# EasyEDA Pro project ProPrj_PCB_PoolMaster_Addons_2025-04-24.epro

# Board PCB_PCB_PoolMaster_2025-04-23
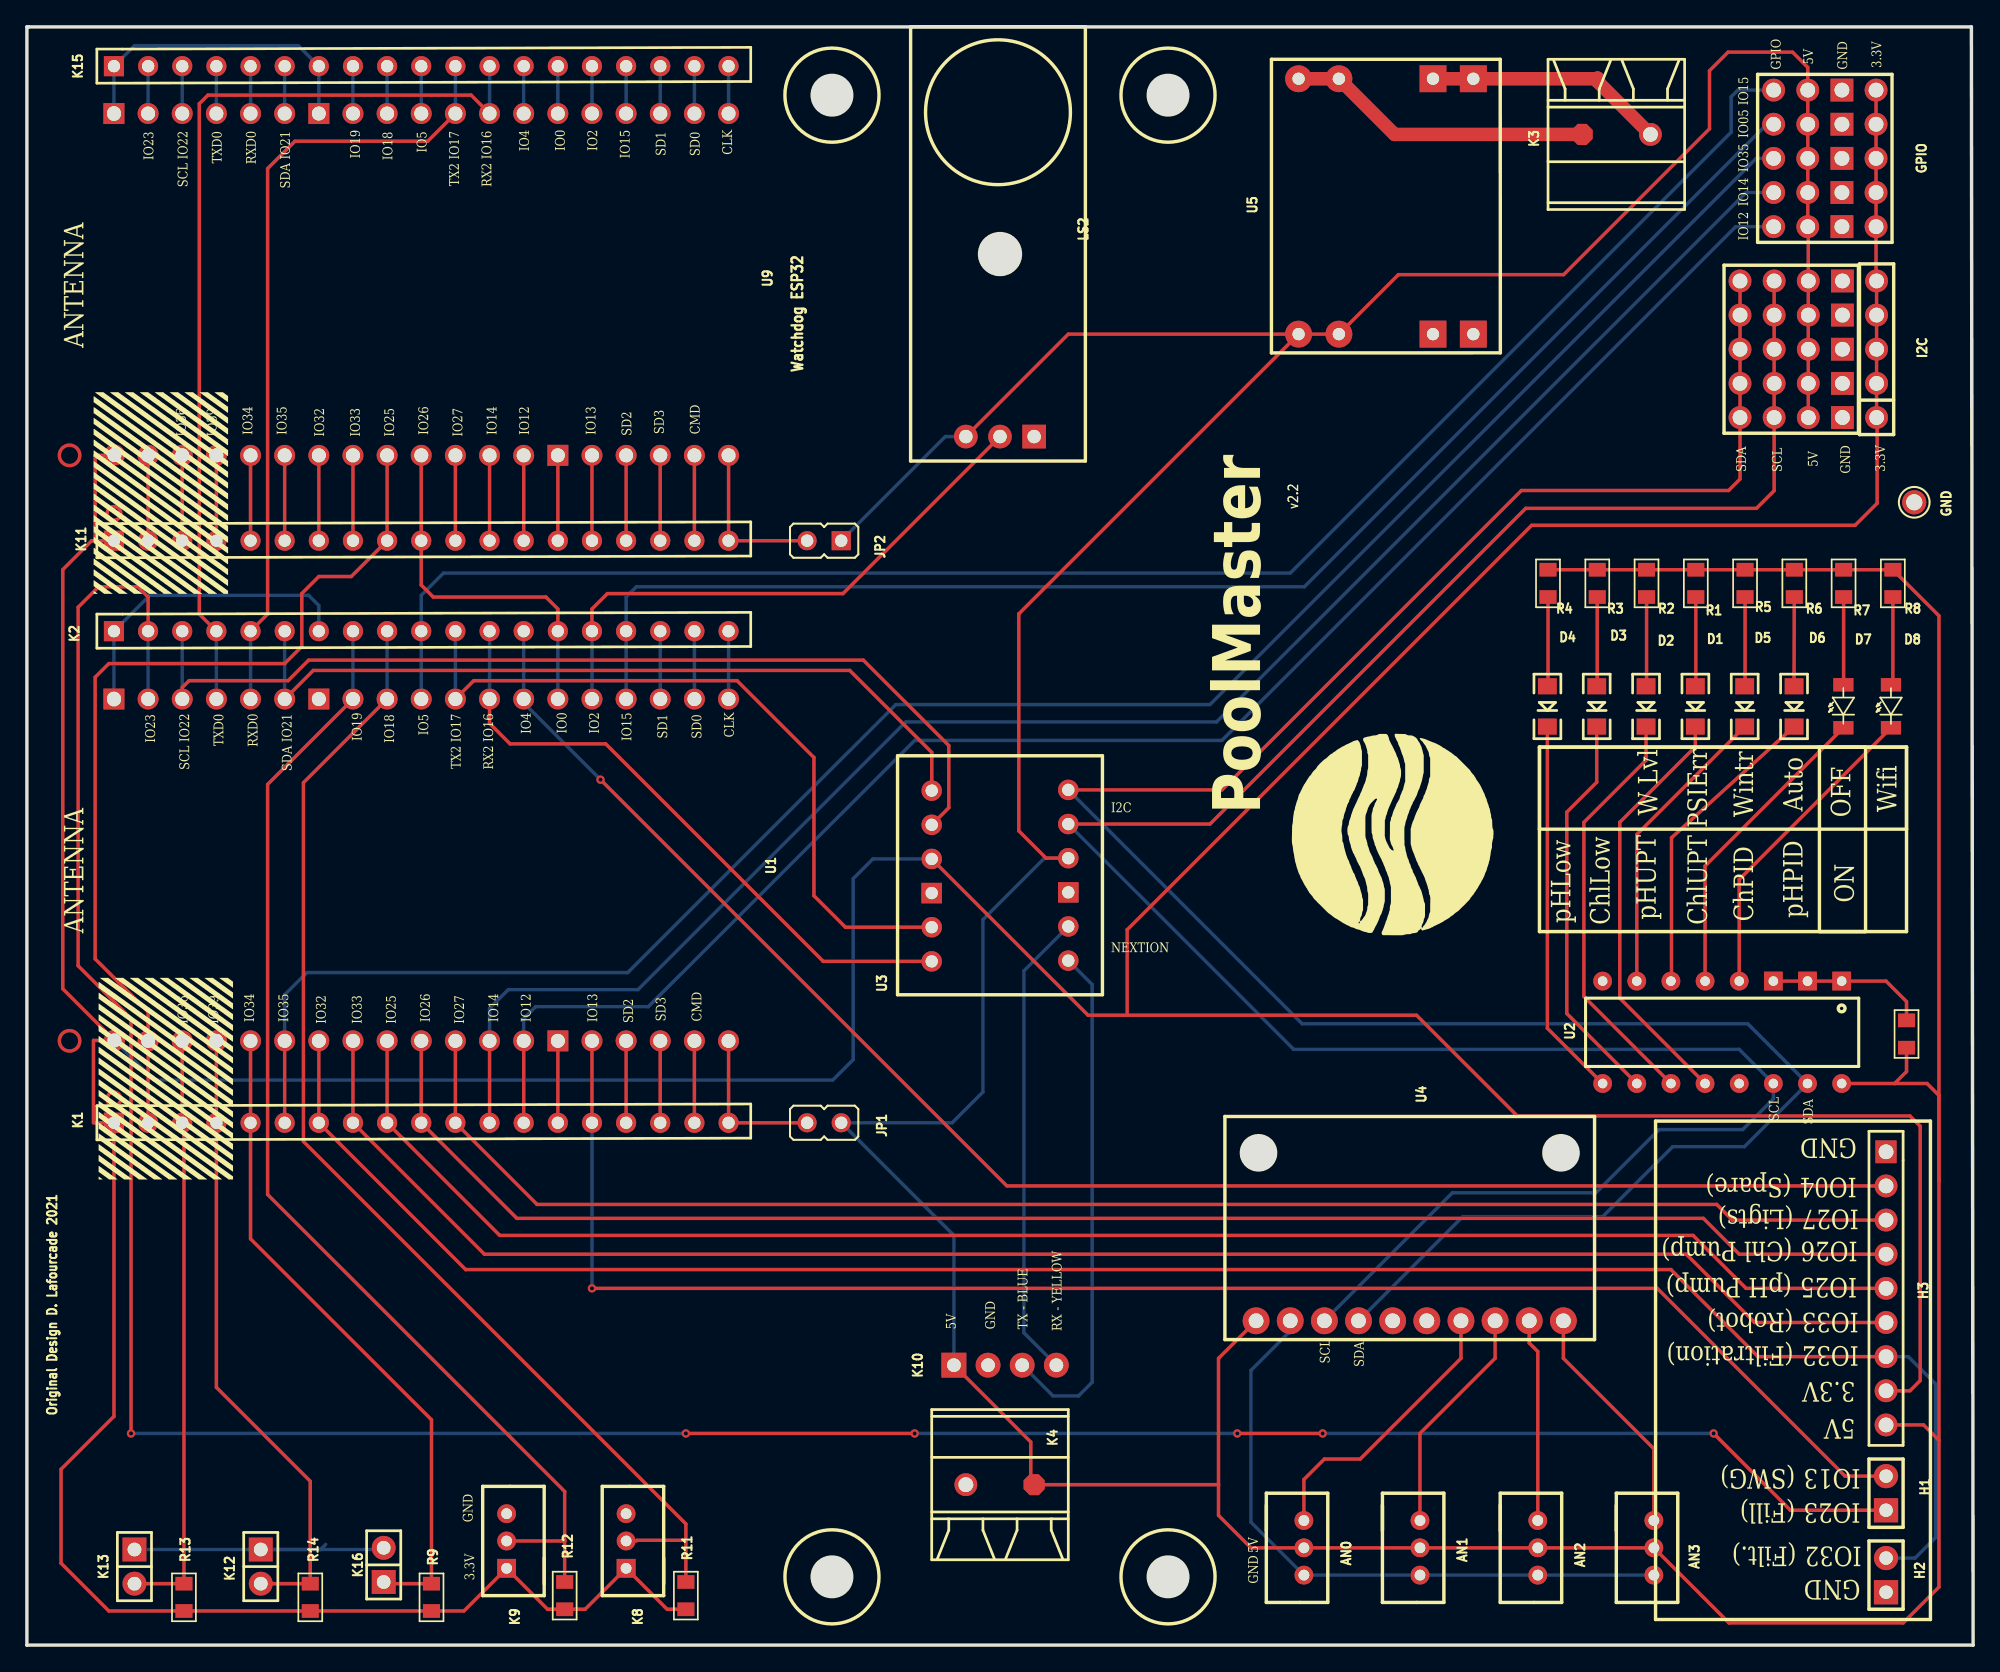
[diagram p0: board, top side]
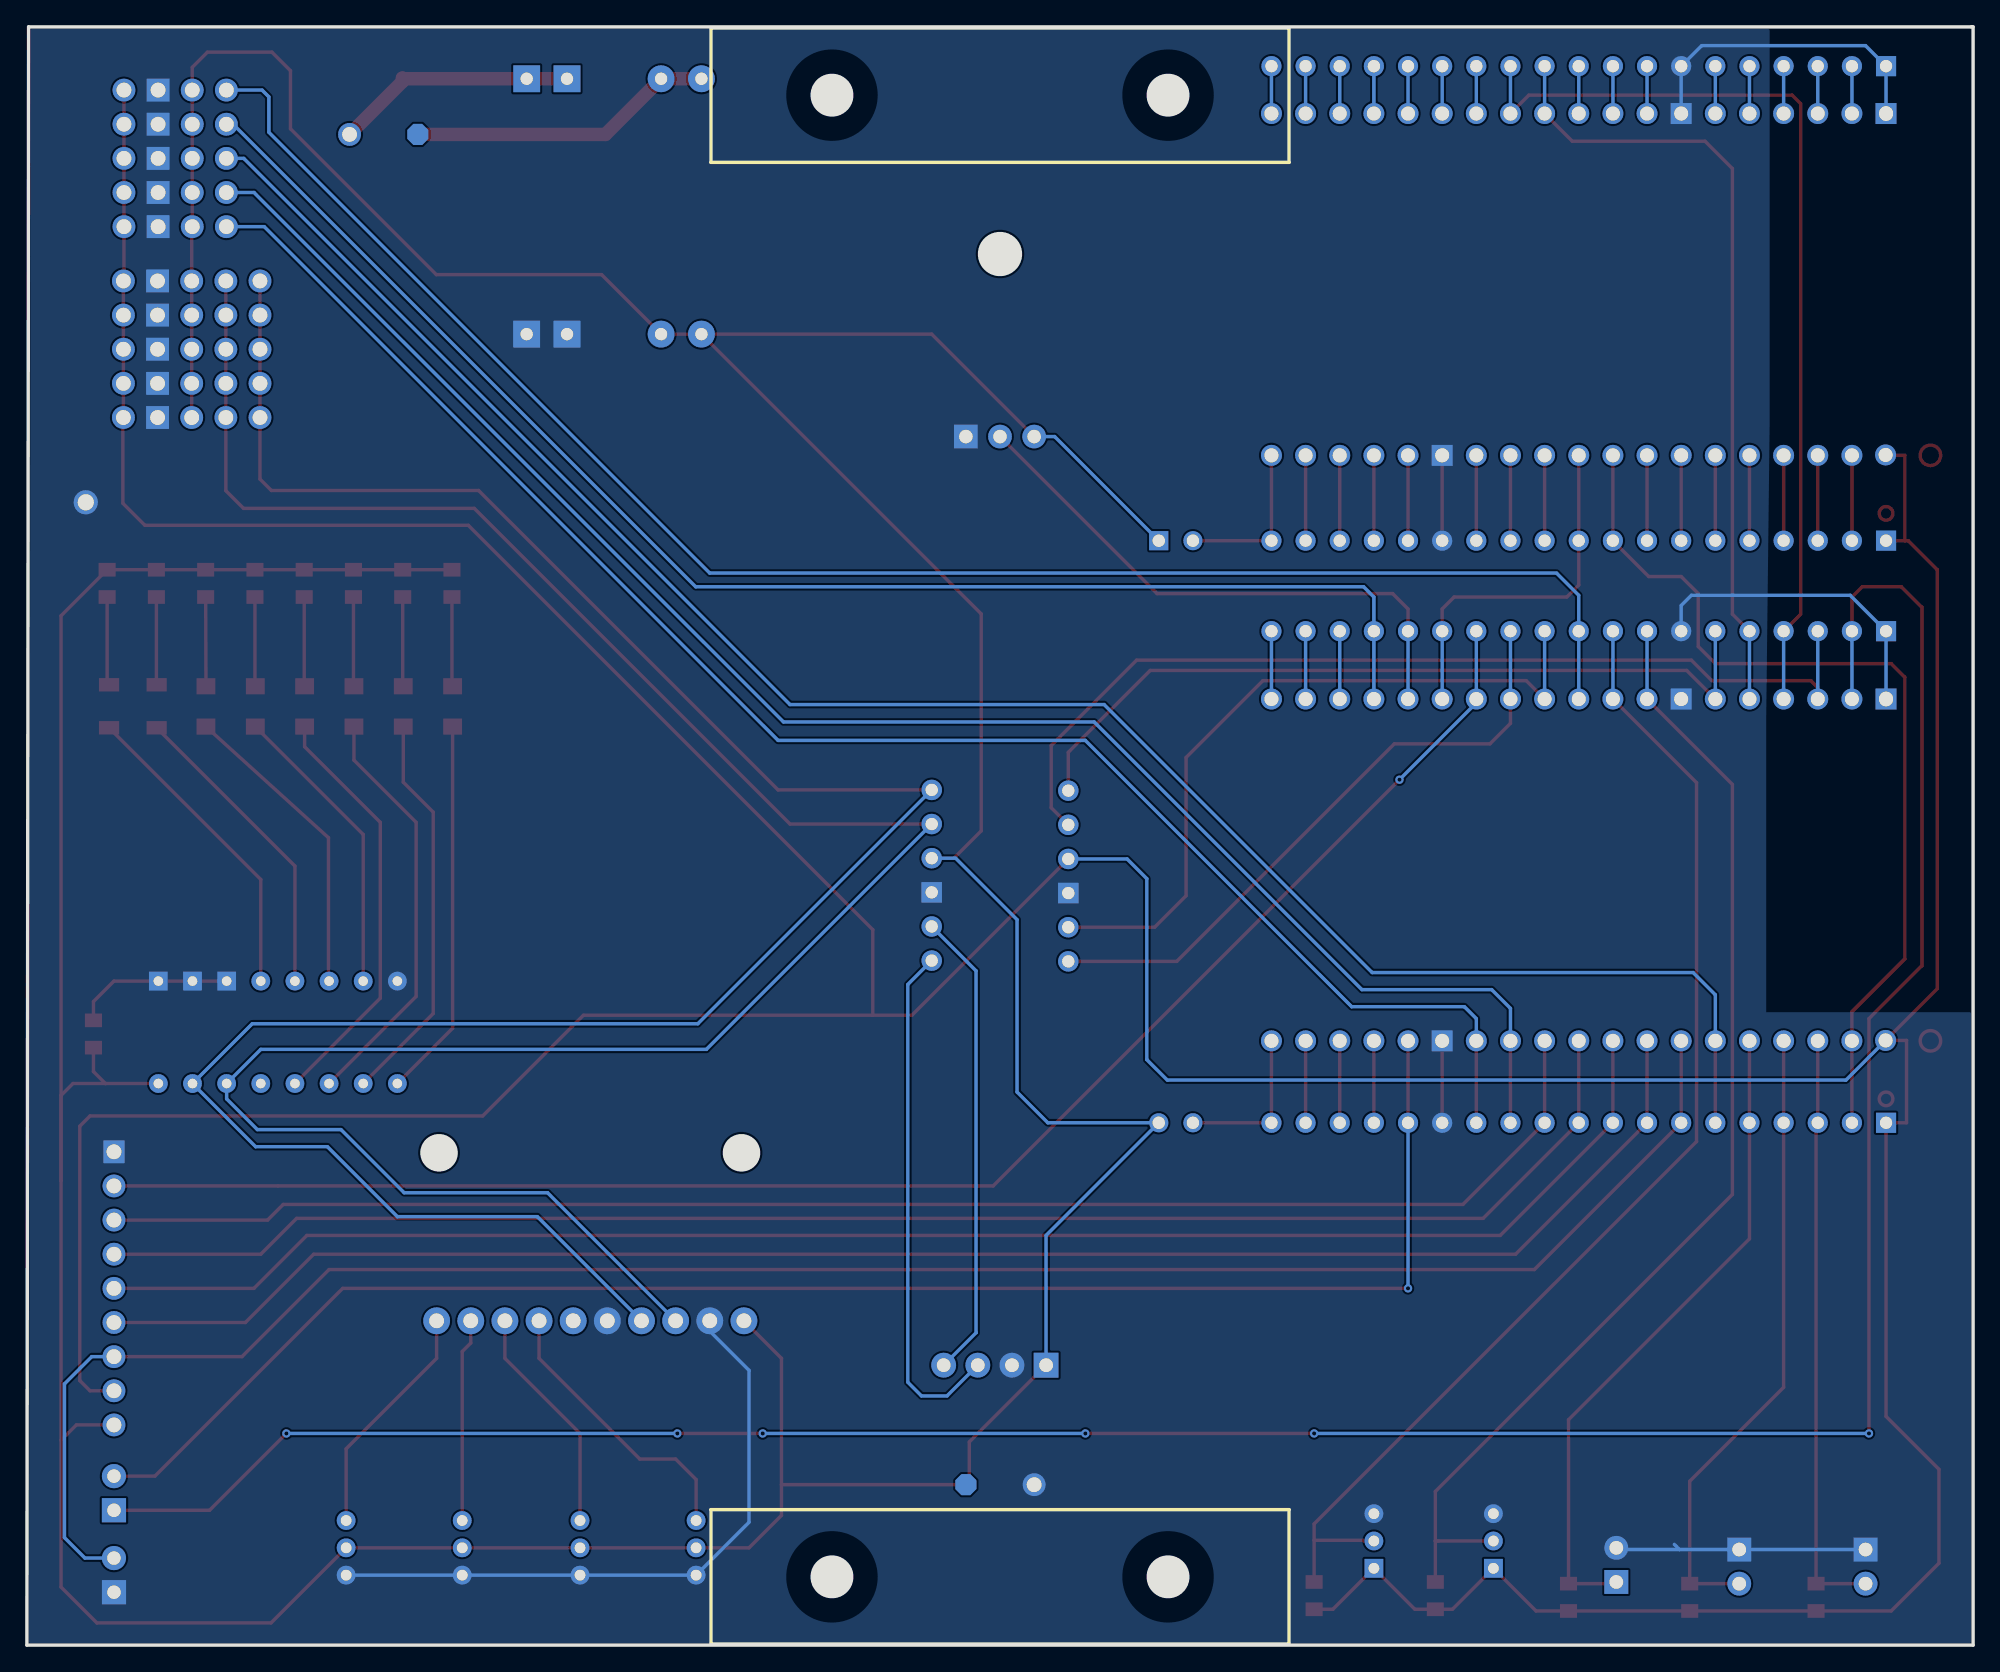
[diagram p1: board, bottom side, seen from below]

Outline 144.78 x 120.4 mm; copper layers: Top Layer, Bottom Layer. Coordinates in mm from the lower left corner of the outline.
Outline path: 0.13,120.4 0,120.4 0,0 144.78,0 144.65,120.4 0.14,120.4
Stack: Top Layer 0.035mm / Dielectric1 1.51mm FR4 er 4.5 / Bottom Layer 0.035mm

## Design rules (mm)
spacing Default (default): track to track 0.152, other pairs 0 to 0.152
track width Default (default): min 0.254, default 0.254, max 25.4
differential pair differentialPair (default): width min 0.127, default 0.254, max 2.54; gap min 0.152, default 0.152
via Default (default): diameter min 0.61, default 0.61, max 100.025; hole min 0.305, default 0.305, max 59.995
pour e116 uses gge23784

## Placement (name value [footprint] x y rotation side)
AN0  Orp  [JST_1X3_2MM_AW]  95 6.22 180 top
AN1  pH  [JST_1X3_2MM_AW]  103.63 6.22 180 top
AN2  W Press  [JST_1X3_2MM_AW]  112.4 6.22 180 top
AN3  RFU  [JST_1X3_2MM_AW]  121.03 6.22 180 top
C1  100n  [0805C-GENERIC]  139.83 44.7 90 top
D1  Red  [SMD-LED-1206-PACKAGE-RED-FP]  124.12 69.84 270 top
D2  Red  [SMD-LED-1206-PACKAGE-RED-FP]  120.45 69.84 270 top
D3  Red  [SMD-LED-1206-PACKAGE-RED-FP]  116.78 69.84 270 top
D4  Red  [SMD-LED-1206-PACKAGE-RED-FP]  113.11 69.84 270 top
D5  Green  [SMD-LED-1206-PACKAGE-GREEN-FP]  127.79 69.84 270 top
D6  Green  [SMD-LED-1206-PACKAGE-GREEN-FP]  131.46 69.84 270 top
D7  Yellow  [SMD-LED-1206]  135.13 69.85 270 top
D8  Blue  [SMD-LED-1206]  138.67 69.85 270 top
GND  TESTPOINT  [TESTPOINT-TH_BD2.0-D1.0_TESTPOINT-TH_BD2.0-D1.0]  140.4 85.03 0 top
GPIO  HX PZ2.54-4x5P ZZ  [HDR-TH_20P-P2.54-V-M-R4-C5-S2.54#2]  133.75 110.61 90 top
H1  Header-Male-2.54_1x2  [HDR-TH_2P-P2.54-V-M-1]  138.3 11.3 90 top
H2  Header-Male-2.54_1x2  [HDR-TH_2P-P2.54-V-M-1]  138.3 5.21 90 top
H3  Header-Female-2.54_1x9  [HDR-TH_9P-P2.54-V-F-1]  138.3 26.54 270 top
I2C  HX PZ2.54-4x5P ZZ  [HDR-TH_20P-P2.54-V-M-R4-C5-S2.54]  131.25 96.41 90 top
JP1  U/L  [JUMPER-2.54#2]  58.04 38.86 270 top
JP2  U/L  [JUMPER-2.54]  60.58 82.17 90 top
K1  Header 19  [HDR1X19]  29.34 38.86 0 top
K2  Header 19  [HDR1X19]  29.34 75.44 0 top
K3  4.5-24V  [MKDS3_2RMI]  115.7 112.39 0 top
K4  Output 5V  [MKDS3_2RMI]  74.93 11.94 180 top
K8  Air T  [JST_1X3_2MM_AW#2]  44.58 8.76 0 top
K9  Water T  [JST_1X3_2MM_AW#2]  35.69 8.76 0 top
K10  Display  [HEADER-1X4-PTH-FOOTPRINT-1]  72.77 20.83 0 top
K11  Header 19  [HDR1X19]  29.34 82.17 0 top
K12  Chl Level  [HEADER-1X2#2]  17.4 4.57 180 top
K13  pH Level  [HEADER-1X2#2]  8 4.57 180 top
K15  Header 19  [HDR1X19]  29.34 117.47 0 top
K16  Pool Level  [HEADER-1X2]  26.54 4.7 180 top
LS2  MH-FMD_BUZZER_MODULE COPY  [MH-FMD_ACTIVE_BUZZER_MODULE]  78.74 120.4 270 top
R1  3k3  [0805R-33]  124.15 79.76 270 top
R2  3k3  [0805R-33]  120.49 79.76 270 top
R3  3k3  [0805R-33]  116.82 79.76 270 top
R4  3k3  [0805R-33]  113.16 79.76 270 top
R5  3k3  [0805R-33]  127.82 79.76 270 top
R6  3k3  [0805R-33]  131.48 79.76 270 top
R7  3k3  [0805R-33]  135.15 79.76 270 top
R8  3k3  [0805R-33]  138.81 79.76 270 top
R9  10k  [0805R-10K]  30.1 2.54 90 top
R11  10k  [0805R-10K]  49.02 2.67 90 top
R12  10k  [0805R-10K]  40 2.67 90 top
R13  10k  [0805R-10K]  11.68 2.54 90 top
R14  10k  [0805R-10K]  21.08 2.54 90 top
U1  ESP32 DevKit  [ESP32-DEVKITC-32D_MODULE_ESP32-DEVKITC-32D]  29.08 57.66 90 top
U2  PCF8574AN  [DIP16]  126.11 45.59 180 top
U3  SHIFTER 4CH  [SPARKFUN_LOGIC_LEVEL_CONVERTER]  72.39 50.93 0 top
U4  ADS1115  [COMM-TH_ADS1115-MODULE]  102.87 24.13 0 top
U5  MP1584EN  [DC-DC CONVERTER]  109.6 105.54 270 top
U6  .  [DIN_RAIL_HOLDER]  72.39 5.08 0 top
U7  .  [DIN_RAIL_HOLDER]  72.39 115.32 180 top
U9  ESP32 DevKit  [ESP32-DEVKITC-32D_MODULE_ESP32-DEVKITC-32D]  29.08 101.22 90 top
U12  2541WV-05P  [HDR-TH_5P-P2.54-V-M]  137.6 96.41 90 top

## Footprints (pads in the part's own frame, mm; a bottom-side part is the same pattern mirrored in y, then rotated)
0805C-GENERIC
  rect 1.016x1.27 smd: 1(-0.254,0) 2(1.778,0)
0805R-10K
  rect 1.016x1.27 smd: 1(0,0) 2(2.032,0)
0805R-33
  rect 1.016x1.27 smd: 1(-0.254,0) 2(1.778,0)
COMM-TH_ADS1115-MODULE
  round 2 hole 1.1: 1(-11.43,0) 2(-8.89,0) 3(-6.35,0) 4(-3.81,0) 5(-1.27,0) 6(1.27,0) 7(3.81,0) 8(6.35,0) 9(8.89,0) 10(11.43,0)
DC-DC CONVERTER
  rect 2x2 hole 0.914: 1(-11,-2) 2(-11,-5) 7(8,-5) 8(8,-2)
  round 2 hole 0.914: 3(-11,-12) 4(-11,-15) 5(8,-15) 6(8,-12)
DIP16
  rect 1.397x1.397 hole 0.711: 1(-8.89,-3.81) 2(-6.35,-3.81) 3(-3.81,-3.81)
  round 1.397 hole 0.711: 4(-1.27,-3.81) 5(1.27,-3.81) 6(3.81,-3.81) 7(6.35,-3.81) 8(8.89,-3.81) 9(8.89,3.81) 10(6.35,3.81) 11(3.81,3.81) 12(1.27,3.81) 13(-1.27,3.81) 14(-3.81,3.81) 15(-6.35,3.81) 16(-8.89,3.81)
ESP32-DEVKITC-32D_MODULE_ESP32-DEVKITC-32D
  round 1.56 hole 1.045x1.04: 1(-12.67,22.572) 2(-12.7,20.066) 3(-12.7,17.526) 4(-12.7,14.986) 5(-12.7,12.446) 6(-12.7,9.906) 7(-12.7,7.366) 8(-12.7,4.826) 9(-12.7,2.286) 10(-12.7,-0.254) 11(-12.7,-2.794) 12(-12.7,-5.334) 13(-12.7,-7.874) 15(-12.7,-12.954) 16(-12.7,-15.494) 17(-12.7,-18.034) 18(-12.7,-20.574) 19(-12.7,-23.114) 21(12.73,20.066) 22(12.73,17.526) 23(12.73,14.986) 24(12.73,12.446) 25(12.73,9.906) 27(12.73,4.826) 28(12.73,2.286) 29(12.73,-0.254) 30(12.73,-2.794) 31(12.73,-5.334) 32(12.73,-7.874) 33(12.73,-10.414) 34(12.73,-12.954) 35(12.73,-15.494) 36(12.73,-18.034) 37(12.73,-20.574) 38(12.73,-23.114)
  rect 1.56x1.56 hole 1.045x1.04: 14(-12.7,-10.414) 26(12.73,7.366)
  rect 1.56x1.56 hole 1.092x1.04: 20(12.73,22.606)
HDR1X19
  rect 1.498x1.498 hole 0.914: 1(-22.86,0)
  round 1.498 hole 0.914: 2(-20.32,0) 3(-17.78,0) 4(-15.24,0) 5(-12.7,0) 6(-10.16,0) 7(-7.62,0) 8(-5.08,0) 9(-2.54,0) 10(0,0) 11(2.54,0) 12(5.08,0) 13(7.62,0) 14(10.16,0) 15(12.7,0) 16(15.24,0) 17(17.78,0) 18(20.32,0) 19(22.86,0)
HDR-TH_2P-P2.54-V-M-1
  rect 1.8x1.8 hole 1: 1(-1.27,0)
  round 1.8 hole 1: 2(1.27,0)
HDR-TH_5P-P2.54-V-M
  round 1.7 hole 1.1: 1(-5.08,0) 2(-2.54,0) 3(0,0) 4(2.54,0) 5(5.08,0)
HDR-TH_9P-P2.54-V-F-1
  rect 1.7x1.575 hole 1.1: 1(-10.16,0)
  round 1.7 hole 1.1: 2(-7.62,0) 3(-5.08,0) 4(-2.54,0) 5(0,0) 6(2.54,0) 7(5.08,0) 8(7.62,0) 9(10.16,0)
HDR-TH_20P-P2.54-V-M-R4-C5-S2.54
  rect 1.7x1.7 hole 1.1: 1(-5.08,-3.81) 5(-2.54,-3.81) 9(0,-3.81) 13(2.54,-3.81) 17(5.08,-3.81)
  round 1.7 hole 1.1: 2(-5.08,-1.27) 3(-5.08,1.27) 4(-5.08,3.81) 6(-2.54,-1.27) 7(-2.54,1.27) 8(-2.54,3.81) 10(0,-1.27) 11(0,1.27) 12(0,3.81) 14(2.54,-1.27) 15(2.54,1.27) 16(2.54,3.81) 18(5.08,-1.27) 19(5.08,1.27) 20(5.08,3.81)
HDR-TH_20P-P2.54-V-M-R4-C5-S2.54#2
  round 1.7 hole 1.1: 1(-5.08,-3.81) 3(-5.08,1.27) 4(-5.08,3.81) 5(-2.54,-3.81) 7(-2.54,1.27) 8(-2.54,3.81) 9(0,-3.81) 11(0,1.27) 12(0,3.81) 13(2.54,-3.81) 15(2.54,1.27) 16(2.54,3.81) 17(5.08,-3.81) 19(5.08,1.27) 20(5.08,3.81)
  rect 1.7x1.7 hole 1.1: 2(-5.08,-1.27) 6(-2.54,-1.27) 10(0,-1.27) 14(2.54,-1.27) 18(5.08,-1.27)
HEADER-1X2
  rect 1.778x1.778 hole 1.021x1.016: 1(0,0)
  round 1.778 hole 1.021x1.016: 2(0,-2.54)
HEADER-1X2#2
  round 1.778 hole 1.021x1.016: 1(0,0)
  rect 1.778x1.778 hole 1.021x1.016: 2(0,-2.54)
HEADER-1X4-PTH-FOOTPRINT-1
  rect 1.85x1.85 hole 1.021x1.016: 1(-3.81,0)
  round 1.85 hole 1.021x1.016: 2(-1.27,-0.001) 3(1.27,-0.001) 4(3.81,-0.001)
JST_1X3_2MM_AW
  round 1.4 hole 0.8: 1(0,1.016) 2(0,-1.016) 3(0,-3.048)
JST_1X3_2MM_AW#2
  round 1.4 hole 0.8: 1(0,1.016) 2(0,-1.016)
  rect 1.4x1.4 hole 0.8: 3(0,-3.048)
JUMPER-2.54
  rect 1.423x1.423 hole 0.919x0.914: 1(0,0)
  round 1.423 hole 0.919x0.914: 2(0,2.54)
JUMPER-2.54#2
  round 1.423 hole 0.919x0.914: 1(0,0) 2(0,2.54)
MH-FMD_ACTIVE_BUZZER_MODULE
  rect 1.762x1.762 hole 1: 1(30.48,-3.81)
  round 1.762 hole 1: 2(30.48,-6.35) 3(30.48,-8.89)
MKDS3_2RMI
  custom 1.571x1.571 hole 1.1: 1(0,0)
  round 1.7 hole 1.1: 2(5.08,0)
SMD-LED-1206
  custom 1x1.5 smd: A(-1.6,0) K(1.6,0)
SMD-LED-1206-PACKAGE-GREEN-FP
  custom 1.2x1.4 smd: 1(-1.5,0) 2(1.5,0)
SMD-LED-1206-PACKAGE-RED-FP
  custom 1.2x1.4 smd: 1(-1.5,0) 2(1.5,0)
SPARKFUN_LOGIC_LEVEL_CONVERTER
  round 1.524 hole 0.914: 1(-5.08,12.644) 2(-5.08,10.104) 3(-5.08,7.564) 5(-5.08,2.484) 6(-5.08,-0.056) 7(5.08,0) 8(5.08,2.54) 10(5.08,7.62) 11(5.08,10.16) 12(5.08,12.7)
  rect 1.524x1.524 hole 0.914: 4(-5.08,5.024) 9(5.08,5.08)
TESTPOINT-TH_BD2.0-D1.0_TESTPOINT-TH_BD2.0-D1.0
  round 1.8 hole 1.2: 1(0,0)

## Nets
3V3: GPIO.1 GPIO.5 GPIO.9 GPIO.13 GPIO.17 H3.8 K1.1 K8.3 K9.3 K11.1 R9.1 R11.1 R12.1 R13.1 R14.1 U1.1 U3.3 U9.1 U12.1 U12.2 U12.3 U12.4 U12.5
5V: AN0.2 AN1.2 AN2.2 AN3.2 C1.1 GPIO.3 GPIO.7 GPIO.11 GPIO.15 GPIO.19 H3.9 I2C.2 I2C.6 I2C.10 I2C.14 I2C.18 JP1.2 JP2.1 K4.1 K10.1 LS2.3 R1.1 R2.1 R3.1 R4.1 R5.1 R6.1 R7.1 R8.1 U2.16 U3.10 U4.1 U5.5 U5.6
GND: AN0.1 AN1.1 AN2.1 AN3.1 C1.2 GND.1 GPIO.2 GPIO.6 GPIO.10 GPIO.14 GPIO.18 H2.1 H3.1 I2C.1 I2C.5 I2C.9 I2C.13 I2C.17 K1.14 K2.1 K2.7 K4.2 K8.1 K9.1 K10.2 K11.14 K12.2 K13.2 K15.1 K15.7 K16.2 LS2.1 U1.14 U1.20 U1.26 U2.1 U2.2 U2.3 U2.8 U3.4 U3.9 U4.2 U4.5 U5.7 U5.8 U9.14 U9.20 U9.26
D1_1: D1.1 R1.2
D1_2: D1.2 U2.12
D2_1: D2.1 R2.2
D3_1: D3.1 R3.2
D4_1: D4.1 R4.2
D5_1: D5.1 R5.2
D6_1: D6.1 R6.2
D7_A: D7.A R7.2
K3_1: K3.1 U5.3 U5.4
K3_2: K3.2 U5.1 U5.2
K10_3: K10.3 U3.7
K10_4: K10.4 U3.8
R8_2: D8.A R8.2
RESET: K1.2 K11.9 U1.2 U9.9
U1_3: K1.3 K13.1 R13.2 U1.3
U1_4: K1.4 K12.1 R14.2 U1.4
U1_5: K1.5 K16.1 R9.2 U1.5
U1_6: GPIO.12 K1.6 U1.6
U1_7: H2.2 H3.7 K1.7 U1.7
U1_8: H3.6 K1.8 U1.8
U1_9: H3.5 K1.9 U1.9
U1_10: H3.4 K1.10 U1.10
U1_11: H3.3 K1.11 U1.11
U1_12: GPIO.8 K1.12 U1.12
U1_13: GPIO.4 K1.13 U1.13
U1_15: H1.2 K1.15 U1.15
U1_16: K1.16 U1.16
U1_17: K1.17 U1.17
U1_18: K1.18 U1.18
U1_19: JP1.1 K1.19 U1.19
U1_21: H1.1 K2.2 U1.21
U1_22: K2.3 U1.22 U3.2
U1_23: K2.4 K15.12 U1.23 U9.31
U1_24: K2.5 K15.11 U1.24 U9.30
U1_25: K2.6 U1.25 U3.1
U1_27: K2.8 K9.2 R12.2 U1.27
U1_28: K2.9 K8.2 R11.2 U1.28
U1_29: GPIO.20 K2.10 U1.29
U1_30: K2.11 U1.30 U3.5
U1_31: K2.12 U1.31 U3.6
U1_32: H3.2 K2.13 U1.32
U1_33: K2.14 K11.10 U1.33 U9.10
U1_34: K2.15 LS2.2 U1.34
U1_35: GPIO.16 K2.16 U1.35
U1_36: K2.17 U1.36
U1_37: K2.18 U1.37
U1_38: K2.19 U1.38
U2_4: D8.K U2.4
U2_5: D7.K U2.5
U2_6: D6.2 U2.6
U2_7: D5.2 U2.7
U2_9: D4.2 U2.9
U2_10: D3.2 U2.10
U2_11: D2.2 U2.11
U2_14: I2C.3 I2C.7 I2C.11 I2C.15 I2C.19 U2.14 U3.11 U4.3
U2_15: I2C.4 I2C.8 I2C.12 I2C.16 I2C.20 U2.15 U3.12 U4.4
U4_7: AN0.3 U4.7
U4_8: AN1.3 U4.8
U4_9: AN2.3 U4.9
U4_10: AN3.3 U4.10
U9_2: K11.2 U9.2
U9_3: K11.3 U9.3
U9_4: K11.4 U9.4
U9_5: K11.5 U9.5
U9_6: K11.6 U9.6
U9_7: K11.7 U9.7
U9_8: K11.8 U9.8
U9_11: K11.11 U9.11
U9_12: K11.12 U9.12
U9_13: K11.13 U9.13
U9_15: K11.15 U9.15
U9_16: K11.16 U9.16
U9_17: K11.17 U9.17
U9_18: K11.18 U9.18
U9_19: JP2.2 K11.19 U9.19
U9_21: K15.2 U9.21
U9_22: K15.3 U9.22
U9_23: K15.4 U9.23
U9_24: K15.5 U9.24
U9_25: K15.6 U9.25
U9_27: K15.8 U9.27
U9_28: K15.9 U9.28
U9_29: K15.10 U9.29
U9_32: K15.13 U9.32
U9_33: K15.14 U9.33
U9_34: K15.15 U9.34
U9_35: K15.16 U9.35
U9_36: K15.17 U9.36
U9_37: K15.18 U9.37
U9_38: K15.19 U9.38

Pads without a net: U2 13; U4 6

## Via types
v1: diameter 0.62, hole 0.31, Top Layer to Bottom Layer, 8 vias

## Routing (per net, layer and track width the routed paths; a pad name or vN(x,y) marks a point on that pad's centre or on a via; arc(x,y) is an arc through that point)
3V3: length 432.1
  Top Layer w0.254: 11.68,2.54 32.51,2.54 K9.3 38.73,2.67 R12.1 41.53,2.67 K8.3 47.62,2.67 R11.1 ; R13.1 6.1,2.54 2.54,6.1 2.54,13.08 6.48,17.02 K1.1 4.95,38.86 4.95,44.99 U1.1 ; GPIO.17 GPIO.13 GPIO.9 GPIO.5 GPIO.1 137.56,101.53 U12.5 U12.4 U12.3 U12.2 U12.1 137.64,91.29 137.64,84.95 136,83.31 111.94,83.31 81.85,53.22 81.85,46.86 ; 81.85,46.86 103.38,46.86 110.87,39.37 140.08,39.37 140.84,38.61 140.84,19.69 140.08,18.92 138.3,18.92 ; 81.85,46.86 78.94,46.86 U3.3 ; 5.08,82.17 4.83,82.17 2.67,80.01 2.67,48.83 6.51,44.99 ; 5.08,82.17 K11.1 ; 5.08,82.17 5.08,88.52 6.48,88.52 U9.1
  Bottom Layer w0.254: U3.3 62.94,58.49 61.47,57.02 61.47,43.56 59.94,42.04 9.46,42.04 6.51,44.99
5V: length 442.4
  Top Layer w0.254: 88.65,11.94 88.65,21.34 U4.1 ; 88.65,11.94 88.65,9.65 91.06,7.24 AN0.2 AN1.2 AN3.2 126.62,1.65 139.57,1.65 142.24,4.32 142.24,15.24 ; 88.65,11.94 75.69,11.94 ; 138.3,16.38 141.1,16.38 142.24,15.24 ; 142.24,15.24 142.24,34.54 ; 68.96,20.83 74.68,15.11 74.68,12.06 74.8,11.94 K4.1 ; 138.94,41.78 141.35,41.78 142.24,40.89 ; 138.94,41.78 U2.16 ; 138.94,41.78 139.83,42.67 139.83,44.45 ; 142.24,40.89 142.24,34.54 ; 142.24,40.89 142.24,76.58 R8.1 R7.1 R6.1 R5.1 R1.1 R2.1 R3.1 R4.1 ; 142.24,40.89 142.24,34.54 ; U3.10 75.82,58.55 73.79,60.58 73.79,76.72 94.6,97.54 ; LS2.3 77.47,97.54 U5.5 U5.6 102.03,101.96 114.32,101.96 125.17,112.81 125.17,117.13 126.55,118.51 131.35,118.51 132.48,117.38 GPIO.19 GPIO.15 GPIO.11 GPIO.7 GPIO.3 132.52,105.49 I2C.18 I2C.14 I2C.10 I2C.6 I2C.2
  Bottom Layer w0.254: JP2.1 68.33,89.92 LS2.3 ; U3.10 75.69,58.55 71.12,53.97 71.12,41.15 68.83,38.86 60.58,38.86 68.96,30.48 K10.1
GND: length 143.1
  Top Layer w0.254: 139.83,46.48 139.83,47.88 138.3,49.4 U2.1 U2.2 U2.3 ; U9.14 K11.14 ; 39.5,44.96 K1.14
  Bottom Layer w0.254: K16.2 26.42,7.11 17.4,7.11 ; U1.20 K2.1 9.14,78.1 20.95,78.1 21.72,77.34 K2.7 ; AN3.1 AN1.1 AN0.1 91.06,9.14 91.06,20.45 93.98,23.37 U4.2 ; U9.26 K15.7 20.19,119 8,119 K15.1 U9.20 ; 17.4,7.11 21.84,7.11 22.22,7.49 ; 17.4,7.11 8,7.11 ; 71.63,20.7 K10.2
D1_1: length 6.7
  Top Layer w0.254: R1.2 124.15,71.37 D1.1
D1_2: length 31.5
  Top Layer w0.254: U2.12 118.49,48.13 118.49,61.21 124.12,66.84 D1.2
D2_1: length 6.7
  Top Layer w0.254: R2.2 120.49,71.37 D2.1
D3_1: length 6.7
  Top Layer w0.254: R3.2 116.82,71.38 D3.1
D4_1: length 6.7
  Top Layer w0.254: D4.1 113.16,71.38 R4.2
D5_1: length 6.7
  Top Layer w0.254: R5.2 127.82,71.36 D5.1
D6_1: length 6.6
  Top Layer w0.254: R6.2 131.46,71.34
D7_A: length 6.5
  Top Layer w0.254: R7.2 135.15,71.47 D7.A
K3_1: length 22.8
  Top Layer w1: U5.4 U5.3 101.74,112.39 K3.1
K3_2: length 18.1
  Top Layer w1: 120.78,112.39 116.84,116.33 116.84,116.59 116.79,116.54 U5.1 U5.2
K10_3: length 38.7
  Bottom Layer w0.254: K10.3 76.33,18.54 78.23,18.54 79.25,19.56 79.25,49.15 U3.7
K10_4: length 35
  Bottom Layer w0.254: U3.8 74.17,50.16 74.17,23.24 K10.4
R8_2: length 6.6
  Top Layer w0.254: R8.2 138.81,71.59 D8.A
RESET: length 69.4
  Top Layer w0.254: U9.9 K11.9 24.13,79.5 21.72,79.5 20.45,78.23 20.45,74.29 19.18,73.02 6.1,73.02 5.08,72.01 5.08,51.05 9.02,47.12 K1.2
U1_3: length 44.2
  Top Layer w0.254: 8,4.57 11.68,4.57 ; 11.56,44.96 K1.3 11.68,38.86 R13.2
U1_4: length 47
  Top Layer w0.254: 14.1,44.96 14.1,19.18 21.08,12.19 21.08,4.57 17.4,4.57
U1_5: length 49.6
  Top Layer w0.254: K16.1 26.67,4.57 30.1,4.57 ; 16.64,44.96 K1.5 16.64,30.23 30.1,16.76 R9.2
U1_6: length 146.1
  Top Layer w0.254: 19.18,44.96 K1.6
  Bottom Layer w0.254: GPIO.12 128.65,110.61 88.01,69.98 64.64,69.98 44.7,50.04 20.83,50.04 19.18,48.39 19.18,44.96
U1_7: length 150.2
  Top Layer w0.254: H3.7 128.78,21.46 122.3,27.94 32.64,27.94 K1.7 21.72,44.96
  Bottom Layer w0.254: 138.3,21.46 139.95,21.46 141.99,19.43 141.99,8 140.46,6.48 138.3,6.48
U1_8: length 126.3
  Top Layer w0.254: 24.26,44.96 K1.8 34.04,29.08 123.44,29.08 128.52,24 H3.6
U1_9: length 122.7
  Top Layer w0.254: H3.5 127.89,26.54 123.95,30.48 35.18,30.48 K1.9 26.8,44.96
U1_10: length 119.6
  Top Layer w0.254: 138.3,29.08 127.38,29.08 124.71,31.75 36.45,31.75 K1.10 ; K1.10 29.34,44.96 ; K1.10 29.34,39.33
U1_11: length 115.5
  Top Layer w0.254: H3.3 126.87,31.62 125.71,32.79 37.95,32.79 31.88,38.86 31.88,44.96
U1_12: length 129.2
  Top Layer w0.254: 34.42,44.96 K1.12
  Bottom Layer w0.254: 34.42,44.96 34.42,47.37 35.81,48.77 45.47,48.77 65.38,68.68 88.49,68.68 127.88,108.07 GPIO.8
U1_13: length 125.1
  Top Layer w0.254: 36.96,44.96 36.96,38.86
  Bottom Layer w0.254: 36.96,44.96 36.96,46.61 37.85,47.5 46.23,47.5 66.04,67.31 88.9,67.31 127.12,105.53 GPIO.4
U1_15: length 120.5
  Top Layer w0.254: H1.2 135.25,12.57 121.28,26.54 v1(42.04,26.54) ; 42.04,44.96 K1.15
  Bottom Layer w0.254: v1(42.04,26.54) K1.15
U1_16: length 6.1
  Top Layer w0.254: 44.58,44.96 K1.16
U1_17: length 6.1
  Top Layer w0.254: 47.12,44.96 K1.17
U1_18: length 6.1
  Top Layer w0.254: 49.66,44.96 K1.18
U1_19: length 11.9
  Top Layer w0.254: 52.2,44.96 K1.19 JP1.1
U1_21: length 209.8
  Top Layer w0.254: H1.1 131.19,10.03 v1(125.48,15.75) ; v1(7.75,15.75) 7.75,46.61 3.81,50.55 3.81,77.22 5.33,78.74 8.25,78.74 9.02,77.98 K2.2 ; v1(49.02,15.75) v1(66.04,15.75) ; 90.04,15.75 v1(96.39,15.75)
  Bottom Layer w0.254: v1(7.75,15.75) v1(49.02,15.75) ; K2.2 U1.21 ; v1(96.39,15.75) v1(125.48,15.75) ; v1(66.04,15.75) 90.04,15.75
  vias: v1(90.04,15.75)
U1_22: length 72.8
  Top Layer w0.254: 11.56,70.39 11.56,71.25 12.06,71.75 19.43,71.75 20.95,73.28 62.23,73.28 68.58,66.93 68.58,62.3 U3.2
  Bottom Layer w0.254: K2.3 U1.22
U1_23: length 70.8
  Top Layer w0.254: U9.31 33.05,115.32 13.46,115.32 12.83,114.68 12.83,76.71 14.1,75.44
  Bottom Layer w0.254: 14.1,75.44 U1.23 ; K15.12 U9.31
U1_24: length 59.2
  Top Layer w0.254: U9.30 29.81,111.89 19.94,111.89 17.91,109.85 17.91,76.71 K2.5
  Bottom Layer w0.254: 31.88,117.47 U9.30 ; K2.5 U1.24
U1_25: length 59.4
  Top Layer w0.254: U3.1 67.31,66.42 61.21,72.52 21.31,72.52 19.18,70.39
  Bottom Layer w0.254: K2.6 U1.25
U1_27: length 86.5
  Top Layer w0.254: 36.32,7.75 40,7.75 ; 40,7.75 39.75,7.75 ; 40,7.75 40,11.43 17.91,33.53 17.91,64.04 U1.27 ; 40,7.75 R12.2
  Bottom Layer w0.254: K2.8 U1.27
U1_28: length 88.8
  Top Layer w0.254: 45.34,7.75 45.39,7.8 49.02,7.8 R11.2 ; 49.02,7.8 49.02,9.02 20.57,37.46 20.57,64.17 26.8,70.39
  Bottom Layer w0.254: K2.9 U1.28
U1_29: length 125.4
  Bottom Layer w0.254: U1.29 K2.10 29.34,78.1 30.99,79.76 93.98,79.76 126.78,112.55 126.78,115.19 127.28,115.69 129.94,115.69
U1_30: length 54.7
  Top Layer w0.254: 31.88,70.39 33.24,71.75 52.83,71.75 58.55,66.04 58.55,55.75 60.89,53.41 U3.5
  Bottom Layer w0.254: 31.88,75.44 U1.30
U1_31: length 47.1
  Top Layer w0.254: 34.42,70.39 34.42,68.58 35.94,67.06 43.05,67.06 59.24,50.87 U3.6
  Bottom Layer w0.254: K2.12 U1.31
U1_32: length 121.6
  Top Layer w0.254: H3.2 72.9,34.16 v1(42.67,64.39)
  Bottom Layer w0.254: 36.96,75.44 U1.32 ; 36.96,70.39 36.96,70.1 v1(42.67,64.39)
U1_33: length 27.2
  Top Layer w0.254: K2.14 39.5,77.09 38.61,77.98 30.23,77.98 29.34,78.87 K11.10 U9.10
  Bottom Layer w0.254: K2.14 U1.33
U1_34: length 42.4
  Top Layer w0.254: LS2.2 60.71,78.23 43.18,78.23 42.04,77.09 K2.15
  Bottom Layer w0.254: K2.15 U1.34
U1_35: length 107.5
  Bottom Layer w0.254: GPIO.16 129.44,113.15 95.03,78.74 45.34,78.74 44.58,77.98 K2.16 U1.35
U1_36: length 5
  Bottom Layer w0.254: K2.17 U1.36
U1_37: length 5
  Bottom Layer w0.254: K2.18 U1.37
U1_38: length 5
  Bottom Layer w0.254: K2.19 U1.38
U2_4: length 23.5
  Top Layer w0.254: U2.4 127.38,56.96 D8.K
U2_5: length 23.1
  Top Layer w0.254: D7.K 124.84,57.96 U2.5
U2_6: length 23
  Top Layer w0.254: U2.6 122.34,49.45 122.34,60.07 D6.2
U2_7: length 22.3
  Top Layer w0.254: 127.79,68.34 119.76,60.31 U2.7
U2_9: length 28.3
  Top Layer w0.254: U2.9 113.11,45.89 D4.2
U2_10: length 29.6
  Top Layer w0.254: U2.10 114.55,46.99 114.55,61.98 116.78,64.2 116.78,68.34
U2_11: length 31.2
  Top Layer w0.254: U2.11 115.82,48.26 115.82,61.21 120.45,65.84 120.45,68.34
U2_14: length 180.2
  Top Layer w0.254: I2C.19 I2C.15 I2C.11 I2C.7 I2C.3 129.98,85.89 128.66,84.57 111.5,84.57 88.01,61.09 U3.11
  Bottom Layer w0.254: U3.11 94.23,44.32 127.38,44.32 U2.14 129.92,40.64 127.63,38.35 121.41,38.35 116.71,33.66 106.04,33.66 U4.3
U2_15: length 179
  Top Layer w0.254: U3.12 88.9,63.63 111.18,85.9 126.59,85.9 127.44,86.75 I2C.4 I2C.8 I2C.12 I2C.16 I2C.20
  Bottom Layer w0.254: U4.4 106.81,31.88 117.22,31.88 122.43,37.08 127.76,37.08 U2.15 128.02,46.23 94.87,46.23 U3.12
U4_7: length 21.3
  Top Layer w0.254: U4.7 106.68,21.34 99.19,13.84 96.52,13.84 95,12.32 AN0.3
U4_8: length 17.2
  Top Layer w0.254: AN1.3 103.63,15.75 109.22,21.34 U4.8
U4_9: length 15.1
  Top Layer w0.254: 112.39,9.27 112.39,21.84 111.76,22.48 U4.9
U4_10: length 17.6
  Top Layer w0.254: AN3.3 121.03,14.61 114.3,21.34 U4.10
U9_2: length 6.3
  Top Layer w0.254: U9.2 K11.2
U9_3: length 6.3
  Top Layer w0.254: U9.3 K11.3
U9_4: length 6.3
  Top Layer w0.254: U9.4 14.1,82.17
U9_5: length 6.3
  Top Layer w0.254: U9.5 K11.5
U9_6: length 6.3
  Top Layer w0.254: U9.6 K11.6
U9_7: length 6.3
  Top Layer w0.254: U9.7 K11.7
U9_8: length 6.3
  Top Layer w0.254: U9.8 K11.8
U9_11: length 6.3
  Top Layer w0.254: U9.11 31.88,82.17
U9_12: length 6.3
  Top Layer w0.254: U9.12 K11.12
U9_13: length 6.3
  Top Layer w0.254: U9.13 36.96,82.17
U9_15: length 6.3
  Top Layer w0.254: U9.15 K11.15
U9_16: length 6.3
  Top Layer w0.254: U9.16 K11.16
U9_17: length 6.3
  Top Layer w0.254: U9.17 K11.17
U9_18: length 6.3
  Top Layer w0.254: U9.18 K11.18
U9_19: length 12.2
  Top Layer w0.254: U9.19 K11.19 JP2.2
U9_21: length 3.5
  Bottom Layer w0.254: K15.2 U9.21
U9_22: length 3.5
  Bottom Layer w0.254: K15.3 U9.22
U9_23: length 3.5
  Bottom Layer w0.254: 14.1,117.47 U9.23
U9_24: length 3.5
  Bottom Layer w0.254: K15.5 U9.24
U9_25: length 3.5
  Bottom Layer w0.254: K15.6 U9.25
U9_27: length 3.5
  Bottom Layer w0.254: K15.8 U9.27
U9_28: length 3.5
  Bottom Layer w0.254: K15.9 U9.28
U9_29: length 3.5
  Bottom Layer w0.254: K15.10 U9.29
U9_32: length 3.5
  Bottom Layer w0.254: 36.96,117.47 U9.32
U9_33: length 3.5
  Bottom Layer w0.254: K15.14 U9.33
U9_34: length 3.5
  Bottom Layer w0.254: K15.15 U9.34
U9_35: length 3.5
  Bottom Layer w0.254: K15.16 U9.35
U9_36: length 3.5
  Bottom Layer w0.254: K15.17 U9.36
U9_37: length 3.5
  Bottom Layer w0.254: K15.18 U9.37
U9_38: length 3.5
  Bottom Layer w0.254: K15.19 U9.38

## Copper pours and planes (outline as drawn; the poured copper is in the pictures)
GND on Bottom Layer: 0.06,-0.06 -0.13,46.99 15.49,46.99 15.49,68.83 15.24,90.68 15.24,120.4 73.22,120.46 144.72,120.46 144.72,0.06 144.84,-0.06

## Text on the board
Top Silkscreen Layer: v2.2 | Original Design D. Lafourcade 2021 | Watchdog ESP32 | 5V | I2C | NEXTION | IO23 | IO36 | SCL IO22 | IO39 | TXD0 | IO34 | RXD0 | IO35 | SDA IO21 | IO32 | IO19 | IO33 | IO18 | IO25 | IO5 | IO26 | TX2 IO17 | IO27 | GND | 3.3V | RX2 IO16 | IO14 | IO4 | IO12 | IO0 | IO13 | IO2 | IO15 | SD2 | SD3 | SD1 | SD0 | CMD | CLK | TX - BLUE | RX - YELLOW | SCL | SDA | IO05 | GPIO | ANTENNA | pHLow | ChlLow | pHUPT | W Lvl | ChlUPT PSIErr | ChPID    Wintr | pHPID    Auto | OFF | ON | Wifi | IO04 (Spare) | IO25 (pH Pump) | IO26 (Chl Pump) | IO33 (Robot) | IO27 (Ligts) | IO32 (Filtration) | IO13 (SWG) | IO23 (Fill) | IO32 (Filt.) | PoolMaster
